# EasyEDA Pro project 数控UPS.epro, board stm32最小
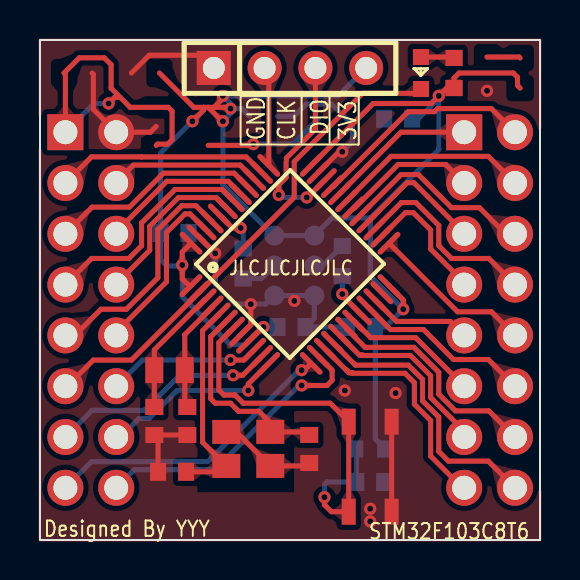
[diagram p3: board, top side]
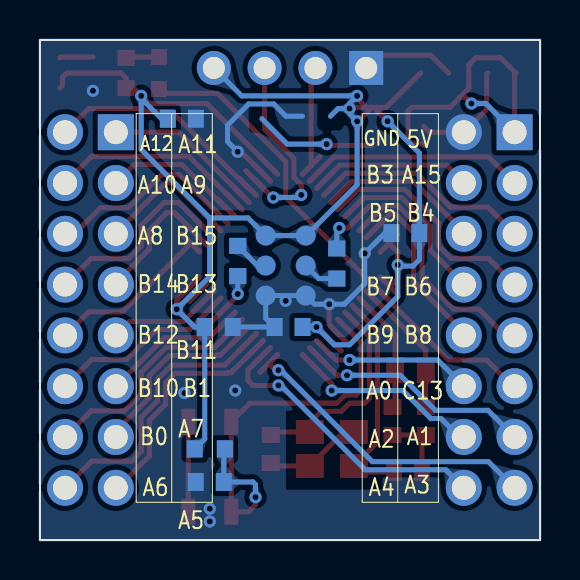
[diagram p4: board, bottom side, seen from below]

Outline 25 x 25 mm; copper layers: Top Layer, Bottom Layer. Coordinates in mm from the lower left corner of the outline.
Outline path: rectangle 0,25 25,0
Stack: Top Layer 0.035mm / Dielectric1 1.51mm FR4 er 4.5 / Bottom Layer 0.035mm

## Design rules (mm)
spacing safeClearance (default): track to track 0.152, other pairs 0.152 to 0.3
track width trackWidth (default): min 0.127, default 0.254, max 2.54
differential pair differentialPair (default): width min 0.127, default 0.254, max 2.54; gap min 0.152, default 0.152
via viaSize (default): diameter min 0.5, default 0.61, max 10; hole min 0.3, default 0.305, max 6
spacing safeClearance (default): track to track 0.152, other pairs 0.152 to 0.3
track width trackWidth (default): min 0.127, default 0.254, max 2.54
differential pair differentialPair (default): width min 0.127, default 0.254, max 2.54; gap min 0.152, default 0.152
via viaSize (default): diameter min 0.5, default 0.61, max 10; hole min 0.3, default 0.305, max 6
spacing safeClearance (default): track to track 0.152, other pairs 0.152 to 0.3
track width trackWidth (default): min 0.127, default 0.254, max 2.54
differential pair differentialPair (default): width min 0.127, default 0.254, max 2.54; gap min 0.152, default 0.152
via viaSize (default): diameter min 0.5, default 0.61, max 10; hole min 0.3, default 0.305, max 6
spacing safeClearance (default): track to track 0.152, other pairs 0.152 to 0.3
track width trackWidth (default): min 0.127, default 0.254, max 2.54
differential pair differentialPair (default): width min 0.127, default 0.254, max 2.54; gap min 0.152, default 0.152
via viaSize (default): diameter min 0.5, default 0.61, max 10; hole min 0.3, default 0.305, max 6

## Placement (name value [footprint] x y rotation side)
8M  -  [CRYSTAL-SMD_4P-L3.2-W2.5-BL]  10.41 4.55 0 top
C5  4.7uF  [C0603]  12.57 10.65 0 bottom
C6  100nF  [C0603]  16.06 10.65 0 bottom
C7  100nF  [C0603]  17.91 21.06 180 bottom
C8  100nF  [C0603]  6.73 15.35 0 bottom
C9  100nF  [C0603]  16.51 2.9 180 bottom
C10  10pF  [C0603]  5.72 5.95 270 top
C11  10pF  [C0603]  7.37 5.95 270 top
C12  22pF  [C0603]  6.6 3.41 180 top
C13  22pF  [C0603]  13.46 4.55 90 top
H1  -  [HDR-TH_4P-P2.54-V-M]  12.5 23.6 0 top
H3  -  [HDR-TH_16P-P2.54-V-M-R2-C8-S2.54]  2.54 11.5 270 top
H4  -  [HDR-TH_16P-P2.54-V-M-R2-C8-S2.54]  22.48 11.5 270 top
LED2  -  [LED0603-RD]  19.05 23.35 90 top
R2  10K  [R0603]  15.11 13.95 90 bottom
R3  10K  [R0603]  10.16 13.82 90 bottom
R4  10K  [R0603]  16.51 4.55 0 bottom
R5  1K  [R0603]  20.7 23.35 90 top
STM32F103C8T6  STM32F103C8T6  [LQFP-48_L7.0-W7.0-P0.50-LS9.0-BL]  12.5 13.78 315 top
SW1  3*4*2.5mm 贴片4脚  [SW-SMD_4P-L4.2-W3.3-P2.15-LS5.1]  16.51 3.66 90 top
U1  -  [焊点3*2]  13.72 15.22 180 bottom
X1  32.768k  [CRYSTAL-SMD_L2.0-W1.2]  6.48 8.49 180 top

## Footprints (pads in the part's own frame, mm; a bottom-side part is the same pattern mirrored in y, then rotated)
C0603
  rect 0.8x0.9 smd: 1(-0.7,0) 2(0.7,0)
CRYSTAL-SMD_4P-L3.2-W2.5-BL
  rect 1.4x1.2 smd: 1(-1.1,-0.85) 2(1.1,-0.85) 3(1.1,0.85) 4(-1.1,0.85)
CRYSTAL-SMD_L2.0-W1.2
  rect 0.899x1.3 smd: 1(-0.762,0) 2(0.762,0)
HDR-TH_4P-P2.54-V-M
  rect 1.7x1.7 hole 1.1: 1(-3.81,0)
  round 1.7 hole 1.1: 2(-1.27,0) 3(1.27,0) 4(3.81,0)
HDR-TH_16P-P2.54-V-M-R2-C8-S2.54
  rect 1.8x1.8 hole 1.2: 1(-8.89,-1.27)
  round 1.8 hole 1.2: 2(-8.89,1.27) 3(-6.35,-1.27) 4(-6.35,1.27) 5(-3.81,-1.27) 6(-3.81,1.27) 7(-1.27,-1.27) 8(-1.27,1.27) 9(1.27,-1.27) 10(1.27,1.27) 11(3.81,-1.27) 12(3.81,1.27) 13(6.35,-1.27) 14(6.35,1.27) 15(8.89,-1.27) 16(8.89,1.27)
LED0603-RD
  rect 0.8x0.8 smd: 1(-0.799,-0.004) 2(0.799,0.004)
LQFP-48_L7.0-W7.0-P0.50-LS9.0-BL
  oval 0.27x1.5 smd: 1(-2.75,-4.25) 2(-2.25,-4.25) 3(-1.75,-4.25) 4(-1.25,-4.25) 5(-0.75,-4.25) 6(-0.25,-4.25) 7(0.25,-4.25) 8(0.75,-4.25) 9(1.25,-4.25) 10(1.75,-4.25) 11(2.25,-4.25) 12(2.75,-4.25) 25(2.75,4.25) 26(2.25,4.25) 27(1.75,4.25) 28(1.25,4.25) 29(0.75,4.25) 30(0.25,4.25) 31(-0.25,4.25) 32(-0.75,4.25) 33(-1.25,4.25) 34(-1.75,4.25) 35(-2.25,4.25) 36(-2.75,4.25)
  oval 1.5x0.27 smd: 13(4.25,-2.75) 14(4.25,-2.25) 15(4.25,-1.75) 16(4.25,-1.25) 17(4.25,-0.75) 18(4.25,-0.25) 19(4.25,0.25) 20(4.25,0.75) 21(4.25,1.25) 22(4.25,1.75) 23(4.25,2.25) 24(4.25,2.75) 37(-4.25,2.75) 38(-4.25,2.25) 39(-4.25,1.75) 40(-4.25,1.25) 41(-4.25,0.75) 42(-4.25,0.25) 43(-4.25,-0.25) 44(-4.25,-0.75) 45(-4.25,-1.25) 46(-4.25,-1.75) 47(-4.25,-2.25) 48(-4.25,-2.75)
R0603
  rect 0.806x0.864 smd: 1(-0.753,0) 2(0.753,0)
SW-SMD_4P-L4.2-W3.3-P2.15-LS5.1
  rect 1.3x0.701 smd: 1(-2.251,1.075) 2(2.251,1.075) 3(-2.251,-1.075) 4(2.251,-1.075)
焊点3*2
  round 1 smd: 1(0,0) 2(0,-1.5) 3(0,-3) 4(2,-3) 5(2,-1.5) 6(2,0)

## Nets
As in the schematic.

## Via types
v1: diameter 0.61, hole 0.305, Top Layer to Bottom Layer, 29 vias

## Routing (per net, layer and track width the routed paths; a pad name or vN(x,y) marks a point on that pad's centre or on a via; arc(x,y) is an arc through that point)
3V3: length 86.7
  Top Layer w0.254: v1(11.18,10.65) 11.14,10.65 STM32F103C8T6.9 ; v1(9.53,21.57) 9.46,21.63 8.7,21.63 ; 5.97,23.35 7.69,21.63 8.19,21.63 ; STM32F103C8T6.48 7.11,14.4 v1(7.11,13.75) 7.11,13.06 7.46,12.72 7.55,12.72 ; v1(7.62,20.94) 8.19,21.5 8.19,21.63 ; 8.19,21.63 8.41,21.63 ; v1(18.16,11.54) 18.16,12.01 17.45,12.72 ; 13.56,18.73 16.66,21.83 19.56,21.83 v1(19.94,22.21) 20.33,22.6 R5.1 20.7,23.09 20.96,23.35 23.66,23.35 23.88,23.14 23.88,22.72 24,22.6 ; 8.41,21.63 9.11,20.94 v1(9.14,20.94) ; 8.41,21.63 8.7,21.63 ; 8.7,21.63 9.14,22.08
  Bottom Layer w0.254: R4.2 16.76,5.05 C6.2 17.27,10.65 v1(18.16,11.54) 16.52,13.18 16.52,16.1 ; v1(9.53,21.57) 9.53,21.32 v1(9.14,20.94) 9.14,17.76 11.68,15.22 U1.6 U1.1 14.6,16.1 16.52,16.1 ; v1(9.53,21.57) 10.09,21.57 10.48,21.19 ; v1(9.53,21.57) 9.53,21.83 v1(9.14,22.21) 14.91,22.21 H1.4 ; 16.52,16.1 19.94,19.52 19.94,22.08 ; 19.94,22.08 v1(19.94,22.21) ; 19.94,22.08 18.92,21.06 C7.1 ; 11.87,10.65 v1(11.18,10.65) 10.29,9.76 9.53,9.76 7.11,12.17 v1(7.11,13.75) 7.06,13.7 6.35,13.7 6.03,14.02 C8.1 6.03,19.35 v1(7.62,20.94)
5V: length 16.3
  Top Layer w0.254: 4.01,22.13 4.51,21.63 6.42,21.63 6.6,21.44 6.6,20.01 6.38,19.79 5.87,19.79 5.81,19.73 ; 4.01,22.13 3.74,22.13 v1(3.43,21.83) ; 4.01,22.13 3.56,22.59 3.56,23.77 3.21,24.11 1.97,24.11 1.21,23.35 1.27,23.28 H3.1
  Bottom Layer w0.254: H3.1 2.71,21.83 v1(3.43,21.83)
GND: length 46.7
  Top Layer w0.254: 5.81,20.68 5.52,20.39 H3.2 2.67,21.53 2.67,23.29 2.6,23.35 ; H1.1 8.06,24.24 5.46,24.24 4.57,23.35 ; C12.2 5.9,5.06 C10.2 C11.2 ; v1(10.54,11.79) 10.54,10.76 10.03,10.24 ; STM32F103C8T6.35 14.95,19.41 v1(15.11,19.41) ; 9.31,5.4 9.81,5.4 8M.2 13.31,3.7 C13.1 ; STM32F103C8T6.47 8.76,14.33 v1(8.76,14.33) ; 22.36,22.55 22.36,22.46 v1(22.35,22.46) ; SW1.4 SW1.3
  Bottom Layer w0.254: v1(15.11,19.41) 15.62,19.92 15.62,20.75 14.57,21.8 13.31,21.8 12.7,21.19 11.88,21.19 ; C6.1 C5.2 13.72,11.09 U1.3 U1.4 11.29,11.79 v1(10.54,11.79) 9.78,11.79 8.76,12.81 v1(8.76,14.33) 7.75,15.35 7.43,15.35
  vias: v1(12.72,11.96) v1(15.24,7.47) v1(16.51,1.56) v1(16.51,0.93) v1(17.78,7.35)
BOOT0: length 2.3
  Top Layer w0.254: STM32F103C8T6.44 9.62,15.6 9.91,15.6
  Bottom Layer w0.254: R3.2 10.16,15.48 v1(10.03,15.6)
BOOT1: length 2.3
  Top Layer w0.254: v1(15.11,12.3) 15.11,12.23 STM32F103C8T6.20
  Bottom Layer w0.254: v1(15.11,12.3) R2.1
NRST: length 20.7
  Top Layer w0.254: STM32F103C8T6.7 8.94,9.87 8.94,7.5 9.2,7.25 9.74,7.25 9.75,7.25 10.16,6.84 14.51,6.84 SW1.2 SW1.1 14.57,1.41 14.22,1.76 v1(14.22,2.14)
  Bottom Layer w0.254: R4.1 15.81,4.5 C9.2 14.35,2.9 14.22,2.78 v1(14.22,2.14)
OSC32_IN: length 6.4
  Top Layer w0.254: STM32F103C8T6.3 8.22,12.01 5.72,9.51 X1.2 C10.1
OSC32_OUT: length 5.6
  Top Layer w0.254: C11.1 7.24,6.78 X1.1 7.24,10.27 8.61,11.64 8.61,11.66
OSC_IN: length 10.6
  Top Layer w0.254: C12.1 9.02,3.41 8M.1 8.13,4.89 8.13,10.47 STM32F103C8T6.5
OSC_OUT: length 10.2
  Top Layer w0.254: C13.2 13.31,5.4 11.51,5.4 11.51,5.87 10.95,6.43 9.93,6.43 9.53,6.84 8.76,6.84 8.53,7.07 8.53,10.17 STM32F103C8T6.6
PA0: length 7.9
  Top Layer w0.254: v1(9.53,9) 10.19,9 STM32F103C8T6.10
  Bottom Layer w0.254: 9.64,8.88 v1(9.53,9) 5.12,9 H3.12
PA1: length 11.5
  Top Layer w0.254: v1(9.65,8.24) 10.14,8.24 STM32F103C8T6.11
  Bottom Layer w0.254: v1(9.65,8.24) 6.99,8.24 5.23,6.48 2.6,6.48 H3.13
PA2: length 9.3
  Top Layer w0.254: STM32F103C8T6.12 10.41,7.8 v1(10.41,7.47)
  Bottom Layer w0.254: H3.14 4.03,5.15 4.95,6.08 5.46,6.08 6.86,7.47 v1(10.41,7.47)
PA3: length 14.9
  Top Layer w0.254: STM32F103C8T6.13 13.22,8.49 v1(13.08,8.49)
  Bottom Layer w0.254: v1(13.08,8.49) 12.95,8.49 8.38,3.92 2.58,3.92 H3.15
PA4: length 14.5
  Top Layer w0.254: v1(13.08,7.73) 14.35,7.73 14.6,7.98 14.6,8.49 STM32F103C8T6.14
  Bottom Layer w0.254: H3.16 4.71,3.51 8.74,3.51 12.95,7.73 v1(13.08,7.73)
PA5: length 11.6
  Top Layer w0.254: STM32F103C8T6.15 15.31,8.49 ; 15.31,8.49 15.44,8.36 15.63,8.36 15.6,8.34 18.25,8.34 18.72,7.86 18.72,6.79 19.53,5.97 19.53,4.2 21.12,2.61 H4.15 ; 15.31,8.49 15.37,8.49
PA6: length 13.8
  Top Layer w0.254: 23.75,2.61 22.42,3.94 20.42,3.94 19.94,4.43 19.94,6.14 19.13,6.96 19.13,8.03 18.41,8.74 15.77,8.74 STM32F103C8T6.16
PA7: length 9.2
  Top Layer w0.254: 14.97,10.24 15.97,9.25 16.11,9.25 16.09,9.23 18.52,9.23 19.53,8.22 19.53,7.12 21.21,5.45 H4.13
PA8: length 9.8
  Top Layer w0.254: STM32F103C8T6.29 18.05,18.27 18.92,18.27 20.57,16.62 21.97,16.62 23.28,15.31 23.75,15.31
PA9: length 6.8
  Top Layer w0.254: H4.3 20.28,18.78 17.91,18.78 15.74,16.61 STM32F103C8T6.30
PA10: length 9.9
  Top Layer w0.254: 23.75,17.85 22.42,19.18 17.55,19.18 15.33,16.96
PA11: length 7.5
  Top Layer w0.254: 14.97,17.31 18.05,20.39 H4.1
PA12: length 11.2
  Top Layer w0.254: 23.75,20.39 22.57,21.57 19.88,21.57 19.73,21.42 18.41,21.42 14.66,17.67 STM32F103C8T6.33
PA15: length 10.7
  Top Layer w0.254: STM32F103C8T6.38 10.31,19.15 5.09,19.15 5.08,19.16 2.58,19.16 H3.3
PB0: length 11.3
  Top Layer w0.254: STM32F103C8T6.18 15.33,10.56 16.26,9.63 18.69,9.63 19.94,8.39 19.94,7.29 20.77,6.46 22.44,6.46 23.75,5.15
PB1: length 6.9
  Top Layer w0.254: STM32F103C8T6.19 15.7,10.95 16.54,10.12 18.78,10.12 H4.11
PB3: length 7.6
  Top Layer w0.254: H3.4 3.81,17.89 4.67,18.75 10.01,18.75 STM32F103C8T6.39
PB4: length 10.6
  Top Layer w0.254: H3.5 2.6,16.64 4.47,16.64 6.17,18.34 9.71,18.34 STM32F103C8T6.40
PB5: length 7.6
  Top Layer w0.254: 10.03,17.31 9.41,17.93 6.34,17.93 3.81,15.41 H3.6
PB6: length 11.3
  Top Layer w0.254: STM32F103C8T6.42 9.11,17.53 6.75,17.53 5.08,15.86 5.08,14.71 4.44,14.08 2.58,14.08 H3.7
PB7: length 8.2
  Top Layer w0.254: STM32F103C8T6.43 8.81,17.12 6.92,17.12 5.49,15.69 5.49,14.48 3.81,12.81 H3.8
PB8: length 11.8
  Top Layer w0.254: H3.9 1.74,10.23 3.05,11.54 4.32,11.54 5.89,13.11 5.89,15.52 7.09,16.71 7.8,16.71 8.61,15.9
PB9: length 8.8
  Top Layer w0.254: STM32F103C8T6.46 7.5,16.31 7.26,16.31 6.32,15.38 6.32,12.91 3.81,10.39 H3.10
PB10: length 9
  Top Layer w0.254: 23.75,7.69 22.42,9.02 20.68,9.02 19.18,10.52 17.53,10.52 16.39,11.66
PB11: length 5.2
  Top Layer w0.254: STM32F103C8T6.22 17.83,10.93 20.51,10.93 H4.9
PB12: length 8.2
  Top Layer w0.254: 23.75,10.23 22.57,11.41 20.88,11.41 STM32F103C8T6.25
PB13: length 6.7
  Top Layer w0.254: H4.7 21.21,12.87 19.53,14.54 19.53,15.5 18.67,16.36 18.27,16.36 STM32F103C8T6.26
PB14: length 9.8
  Top Layer w0.254: 23.75,12.77 22.44,14.08 20.57,14.08 19.94,14.71 19.94,15.73 18.8,16.87 18.07,16.87 STM32F103C8T6.27
PB15: length 6.7
  Top Layer w0.254: H4.5 21.21,15.35 18.69,17.86 18.35,17.86 16.39,15.9
PC13: length 25
  Top Layer w0.254: H3.11 1.36,7.69 2.67,9 4.57,9 7.9,12.33 7.9,12.36 7.94,12.36 12.71,17.14 12.71,18.92 16.13,22.33 18.84,22.33 LED2.1
SWCLK: length 5
  Top Layer w0.254: H1.2 11.44,23.39 11.44,18.73
SWDIO: length 9.8
  Top Layer w0.254: H1.3 13.77,20.55 12.32,19.1 12.32,19.02 ; STM32F103C8T6.34 13.37,17.13 v1(13.34,17.13) ; v1(11.94,17.25) 11.94,17.76 12.31,18.13 12.31,18.92
  Bottom Layer w0.254: v1(11.94,17.25) 12.06,17.13 v1(13.34,17.13)
$1N1401: length 6.3
  Top Layer w0.254: 10.73,19.73 10.67,19.79 v1(10.67,19.79) ; 10.73,19.73 8.41,19.73 ; 10.73,19.73 10.79,19.79
  Bottom Layer w0.254: 13.91,21.06 12.63,19.79 v1(10.67,19.79)
$1N1736: length 1.7
  Top Layer w0.254: 24,24.1 23.96,24.15 22.35,24.15
$1N4997: length 1.7
  Top Layer w0.254: LED2.2 20.66,24.15 R5.2
$1N8787: length 1.8
  Bottom Layer w0.254: U1.2 14.13,13.72 R2.2
$1N8790: length 1.8
  Bottom Layer w0.254: U1.5 11.07,13.07 R3.1

## Copper pours and planes (outline as drawn; the poured copper is in the pictures)
GND on Top Layer: -1.65,26.65 26.16,26.65 26.16,-1.8 -1.65,-1.8
GND on Bottom Layer: -4.57,29.19 28.57,29.19 28.57,-4.59 -4.57,-4.59

Small or netless copper shapes (teardrops, artwork), in the pictures only: 113 on Top Layer, 66 on Bottom Layer

## Text on the board
Bottom Silkscreen Layer: GND | A12 | 5V | B4 | A1 | B6 | B8 | A3 | A15 | C13 | B5 | A2 | A4 | B3 | B7 | B9 | A0 | B1 | A9 | A11 | A7 | A5 | B15 | B13 | B11 | A6 | B0 | A10 | A8 | B14 | B12 | B10
Top Silkscreen Layer: JLCJLCJLCJLC | Designed By YYY | STM32F103C8T6 | GND | CLK | DIO | 3V3
